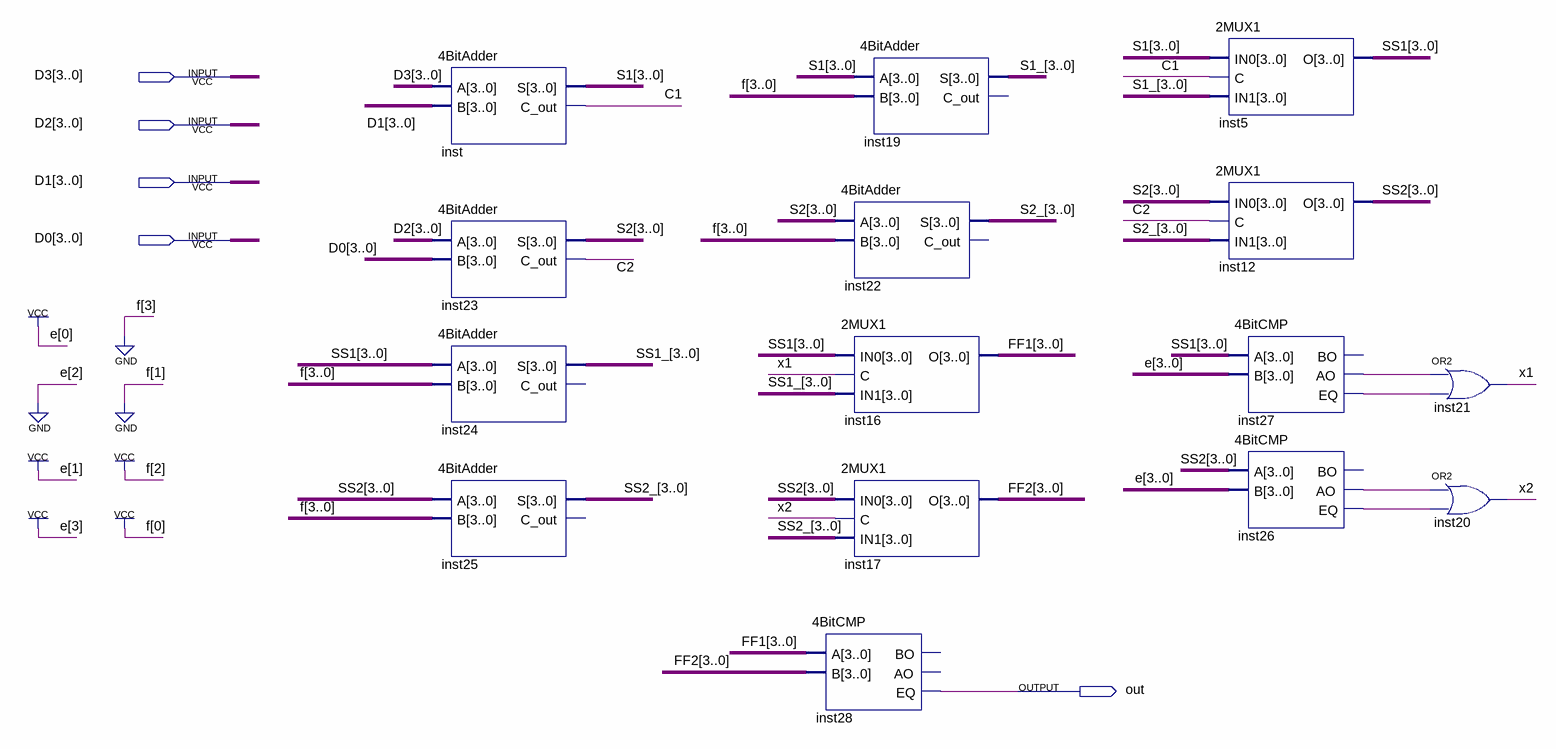
[diagram p0: schematic sheet]
// Quartus schematic myMain11.bdf as structural Verilog: 15 symbols, 5 pins
module myMain11 (
  input  [3:0] D3,
  input  [3:0] D2,
  input  [3:0] D1,
  input  [3:0] D0,
  output out
);

  wire C1, C2, inst26_ao, inst26_eq, inst27_ao, inst27_eq, x1, x2;
  wire [3:0] FF1, FF2, S1, S1_, S2, S2_, SS1, SS1_, SS2, SS2_;

  \4BitAdder  inst (.A(D3), .B(D1), .S(S1), .C_out(C1));
  \4BitAdder  inst23 (.A(D2), .B(D0), .S(S2), .C_out(C2));
  \4BitAdder  inst24 (.A(SS1), .B(4'b0101), .S(SS1_));  // open: C_out
  \4BitAdder  inst25 (.A(SS2), .B(4'b0101), .S(SS2_));  // open: C_out
  \4BitAdder  inst19 (.A(S1), .B(4'b0101), .S(S1_));  // open: C_out
  \4BitAdder  inst22 (.A(S2), .B(4'b0101), .S(S2_));  // open: C_out
  \2MUX1  inst16 (.IN0(SS1), .C(x1), .IN1(SS1_), .O(FF1));
  \2MUX1  inst17 (.IN0(SS2), .C(x2), .IN1(SS2_), .O(FF2));
  \4BitCMP  inst28 (.A(FF1), .B(FF2), .EQ(out));  // open: BO, AO
  \2MUX1  inst5 (.IN0(S1), .C(C1), .IN1(S1_), .O(SS1));
  \2MUX1  inst12 (.IN0(S2), .C(C2), .IN1(S2_), .O(SS2));
  \4BitCMP  inst27 (.A(SS1), .B(4'b1011), .AO(inst27_ao), .EQ(inst27_eq));  // open: BO
  \4BitCMP  inst26 (.A(SS2), .B(4'b1011), .AO(inst26_ao), .EQ(inst26_eq));  // open: BO
  or inst21 (x1, inst27_ao, inst27_eq);
  or inst20 (x2, inst26_ao, inst26_eq);
endmodule
